# Altium schematic sheet LSD150BAG-101-01.SchDoc
size A4; SheetNumber: 6; SheetTotal: 12
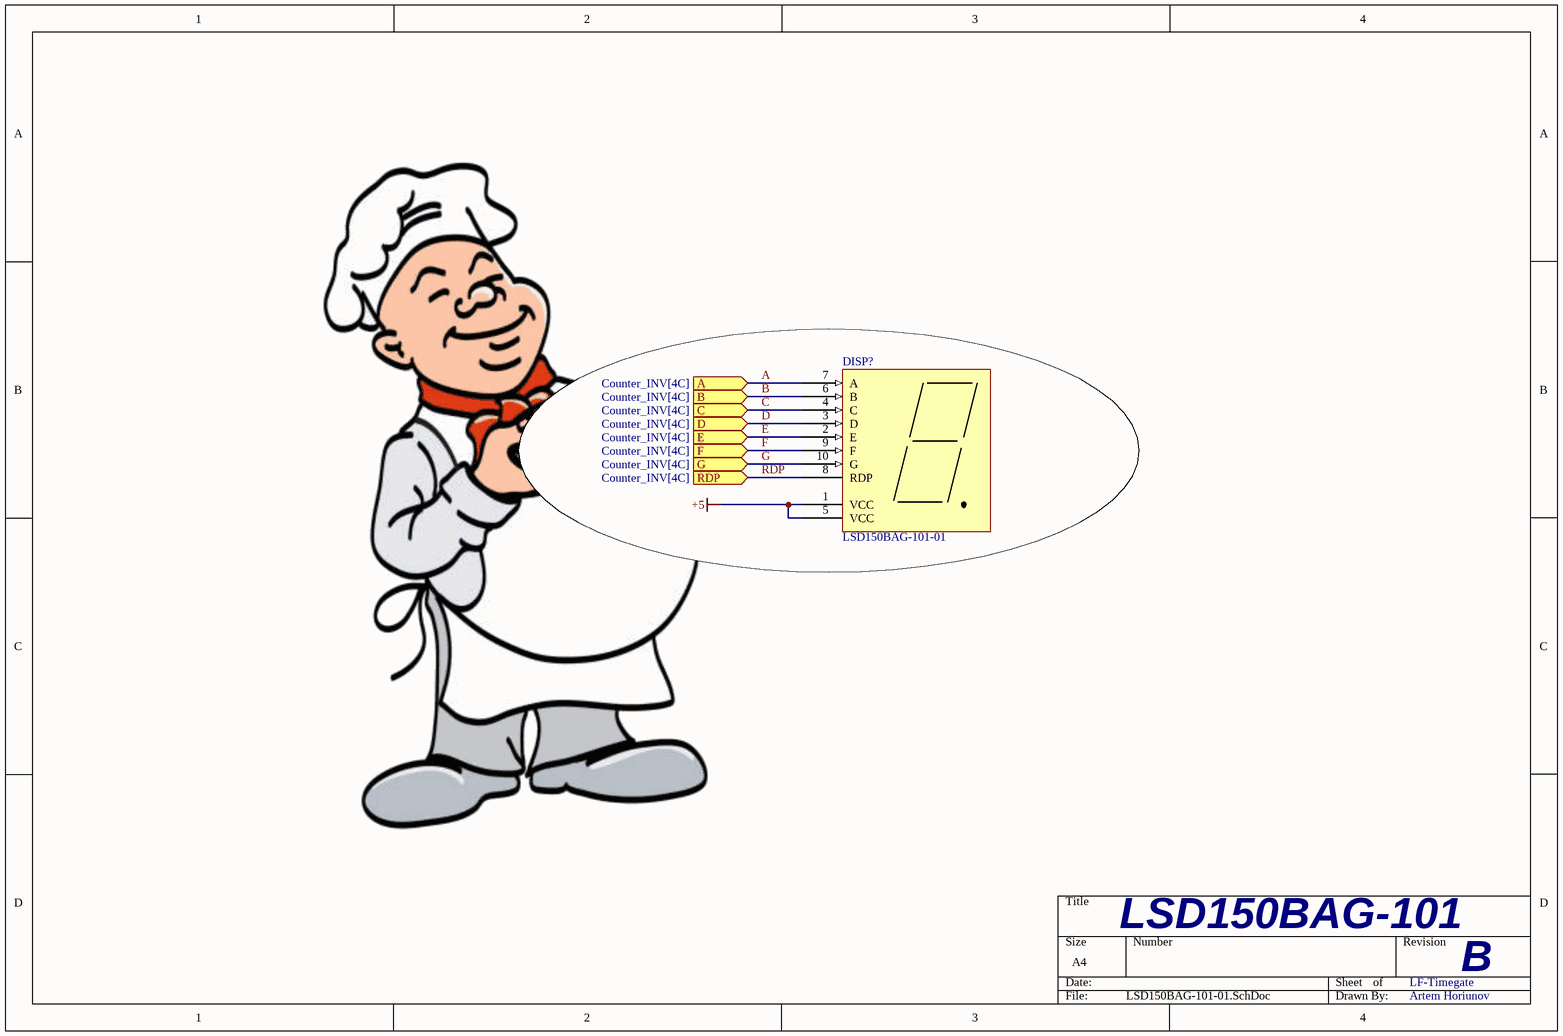
[diagram p0: LSD150BAG-101-01.SchDoc]

## Parts
DISP?  LSD150BAG-101-01  [7 segment display]

## Ports
A (in, see Counter_INV[4C]), B (in, see Counter_INV[4C]), C (in, see Counter_INV[4C]), D (in, see Counter_INV[4C]), E (in, see Counter_INV[4C]), F (in, see Counter_INV[4C]), G (in, see Counter_INV[4C]), RDP (in, see Counter_INV[4C])

## Nets
+5: DISP?.1(VCC) DISP?.5(VCC)
A: DISP?.7(A) ; port A
B: DISP?.6(B) ; port B
C: DISP?.4(C) ; port C
D: DISP?.3(D) ; port D
E: DISP?.2(E) ; port E
F: DISP?.9(F) ; port F
G: DISP?.10(G) ; port G
RDP: DISP?.8(RDP) ; port RDP

## Notes on the sheet
- LSD150BAG-101
- LF-Timegate
- B
- Artem Horiunov

## Library data of the parts
DISP? = CMP-007-00036-2: 7 segment display 1.5 inch